# EAGLE schematic layout (EAGLE 9.6.2)
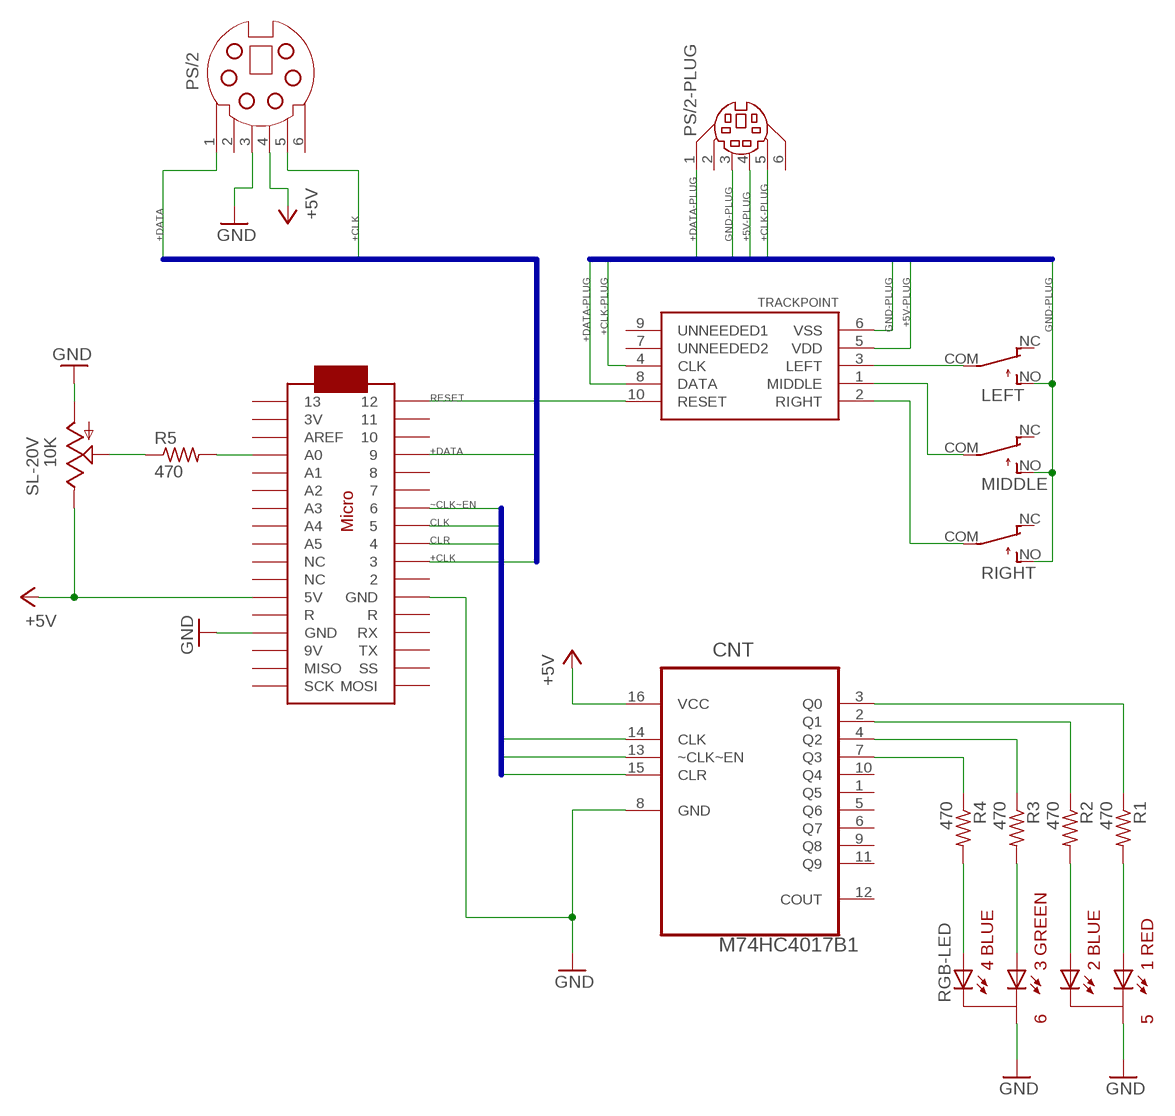
[diagram p0: schematic, sheet 1]

## Parts
CNT  M74HC4017B1  M74HC4017B1R  [DIP254P762X510-16]
PS/2  MDSSV-BC06  [SSV-BC06]
PS/2-PLUG  MDIN06K  [MDIN06K]
R1  470  R-US_0207/10  [0207/10]
R2  470  R-US_0207/10  [0207/10]
R3  470  R-US_0207/10  [0207/10]
R4  470  R-US_0207/10  [0207/10]
R5  470  R-US_0207/10  [0207/10]
RGB-LED  RGBLED  [RGBLED5MM]
TRACKPOINT  BOARD  [BOARD]
U$1  LEFT  D2F  [D2F]
U$2  ARDUINOMICRO  [ARDUINOMICRO]
U$3  MIDDLE  D2F  [D2F]
U$5  RIGHT  D2F  [D2F]
U$6  10K  SL-20V  [SL-20V]

## Nets
+5V: CNT.16(VCC) PS/2.4 U$2.P$23(5V) U$6.4(E)
+5V-PLUG: PS/2-PLUG.4 TRACKPOINT.5(VDD)
+CLK: PS/2.5 U$2.P$10
+CLK-PLUG: PS/2-PLUG.5 TRACKPOINT.4(CLK)
+DATA: PS/2.1 U$2.P$4
+DATA-PLUG: PS/2-PLUG.1 TRACKPOINT.8(DATA)
CLK: CNT.14(CLK) U$2.P$8
CLR: CNT.15(CLR) U$2.P$9
GND: CNT.8(GND) PS/2.3 RGB-LED.C5 RGB-LED.C6 U$2.P$12(GND) U$2.P$21(GND) U$6.1(A)
GND-PLUG: PS/2-PLUG.3 TRACKPOINT.6(VSS) U$1.NO(S) U$3.NO(S) U$5.NO(S)
LED: R4.2 RGB-LED.A4_BLUE
LEFT: TRACKPOINT.3(LEFT) U$1.COM(P)
N$1: CNT.2(Q1) R2.1
N$2: CNT.3(Q0) R1.1
N$3: CNT.4(Q2) R3.1
N$4: CNT.7(Q3) R4.1
N$5: R5.2 U$2.P$31(A0)
N$6: R3.2 RGB-LED.A3_GREEN
N$7: R2.2 RGB-LED.A2_BLUE
N$8: R1.2 RGB-LED.A1_RED
N$10: TRACKPOINT.1(MIDDLE) U$3.COM(P)
N$11: TRACKPOINT.2(RIGHT) U$5.COM(P)
N$12: R5.1 U$6.2(S) U$6.3(S)
RESET: TRACKPOINT.10(RESET) U$2.P$1
~CLK~EN: CNT.13(~CLK~EN) U$2.P$7
Unconnected: CNT.1(Q5) CNT.5(Q6) CNT.6(Q7) CNT.9(Q8) CNT.10(Q4) CNT.11(Q9) CNT.12(COUT) PS/2-PLUG.2 PS/2-PLUG.6 PS/2.2 PS/2.6 TRACKPOINT.7(UNNEEDED2) TRACKPOINT.9(UNNEEDED1) U$1.NC(O) U$2.P$2 U$2.P$3 U$2.P$5 U$2.P$6 U$2.P$11 U$2.P$13(R) U$2.P$14(RX) U$2.P$15(TX) U$2.P$16(SS) U$2.P$17(MOSI) U$2.P$18(SCK) U$2.P$19(MISO) U$2.P$20(9V) U$2.P$22(R) U$2.P$24(NC) U$2.P$25(NC) U$2.P$26(A5) U$2.P$27(A4) U$2.P$28(A3) U$2.P$29(A2) U$2.P$30(A1) U$2.P$32(AREF) U$2.P$33(3V) U$2.P$34 U$3.NC(O) U$5.NC(O)

## Buses
CLK,~CLK~EN,CLR
+DATA,+CLK
+DATA-PLUG,+CLK-PLUG,GND-PLUG,+5V-PLUG

## Library data of the parts
CNT = ST Microelctronics_By_element14_Batch_1:M74HC4017B1R: DECADE COUNTER/DIVIDER; MPN: M74HC4017B1R; OC_FARNELL: 1094301; OC_NEWARK: 89K0898; PACKAGE: PDIP-16; SUPPLIER: STMICROELECTRONICS
PS/2 = con-yamaichi:MDSSV-BC06: YAMAICHI CONNECTOR; OC_FARNELL: unknown; OC_NEWARK: unknown
PS/2-PLUG = con-yamaichi:MDIN06K: YAMAICHI CONNECTOR; OC_FARNELL: unknown; OC_NEWARK: unknown
R1-R5 = rcl:R-US_: RESISTOR, American symbol
RGB-LED = rgb_led:RGBLED
TRACKPOINT = library:BOARD: TrackPoint board with cable broken off
U$1 U$3 U$5 = library:D2F: Omron D2F switch
U$2 = adafruit:ARDUINOMICRO
U$6 = library:SL-20V: Song Huei SL-20V